# EAGLE design ATtiny_TIP120 (EAGLE 8.0.0)
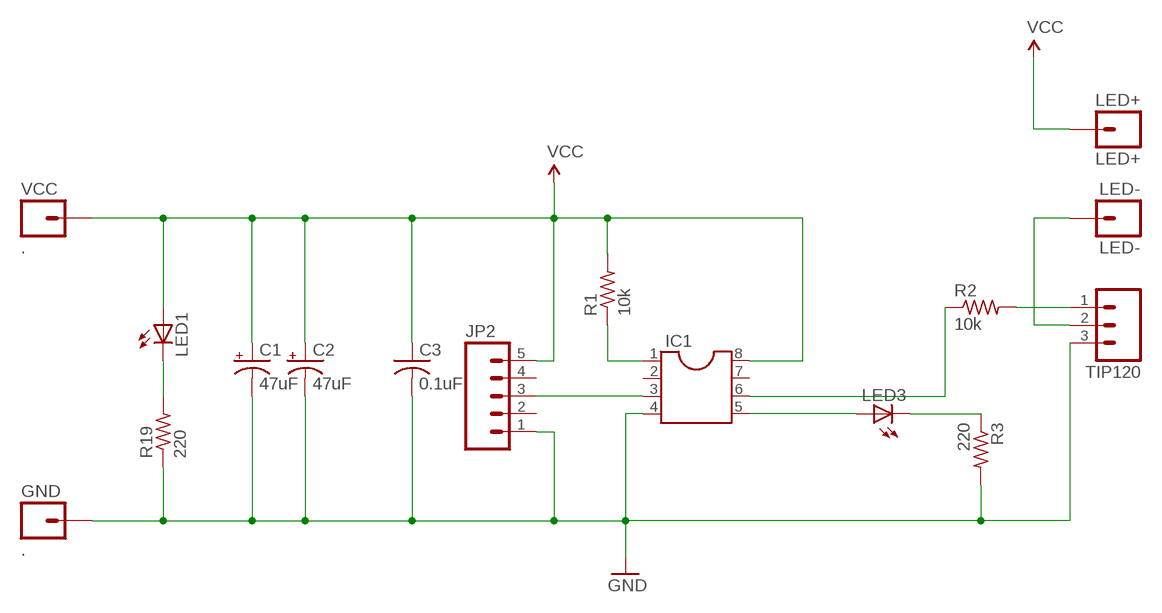
[diagram p0: schematic, sheet 1]

## Parts
C1  47uF  CAP_POLPTH4  [CPOL-RADIAL-1000UF-25V]
C2  47uF  CAP_POLPTH4  [CPOL-RADIAL-1000UF-25V]
C3  0.1uF  C-US025-025X050  [C025-025X050]
GND  .  M01OFFSET  [1X01_OFFSET]
IC1  DIL8S  [SOCKET-08]
JP2  M05LOCK_LONGPADS  [1X05_LOCK_LONGPADS]
LED1  LED5MM  [LED5MM]
LED3  LED5MM  [LED5MM]
LED+  LED+  M01OFFSET  [1X01_OFFSET]
LED-  LED-  M01OFFSET  [1X01_OFFSET]
R1  10k  R-US_0207/7  [0207/7]
R2  10k  R-US_0207/7  [0207/7]
R3  220  R-US_0207/7  [0207/7]
R19  220  R-US_0207/7  [0207/7]
TIP120  M03LOCK_LONGPADS  [1X03_LOCK_LONGPADS]
VCC  .  M01OFFSET  [1X01_OFFSET]

## Nets
GND: C1.2(-) C2.2(-) C3.2 GND.1 IC1.4 JP2.1 R3.2 R19.1 TIP120.3
N$1: IC1.1 R1.1
N$2: IC1.6 R2.1
N$3: IC1.3 JP2.3
N$4: R2.2 TIP120.1
N$6: LED1.K(C) R19.2
N$7: LED3.K(C) R3.1
N$8: LED-.1 TIP120.2
N$10: IC1.5 LED3.A
VCC: C1.1(+) C2.1(+) C3.1 IC1.8 JP2.5 LED1.A LED+.1 R1.2 VCC.1
Unconnected: IC1.2 IC1.7 JP2.2 JP2.4

## Library data of the parts
C1 C2 = SparkFun:CAP_POL: Capacitor Polarized These are standard SMD and PTH capacitors. Normally 10uF, 47uF, and 100uF in electrolytic and tantalum varieties. Always verify the external diameter of the through hole cap, it varies with capacity, voltage, and manufacturer. The EIA devices should be standard.
C3 = adafruit-2014:C-US: CAPACITOR, American symbol
GND LED+ LED- VCC = SparkFun:M01: Header 1 Standard 1-pin 0.1" header. Use with straight break away headers (SKU : PRT-00116), right angle break away headers (PRT-00553), swiss pins (PRT-00743), machine pins (PRT-00117), and female headers (PRT-00115).
IC1 = ic-package:DIL8: Dual In Line / Socket
JP2 = SparkFun:M05: Header 5 Standard 5-pin 0.1" header. Use with straight break away headers (SKU : PRT-00116), right angle break away headers (PRT-00553), swiss pins (PRT-00743), machine pins (PRT-00117), and female headers (PRT-00115). Molex polarized connector foot print use with SKU : PRT-08230 with associated crimp pins and housings.
LED1 LED3 = adafruit-2014:LED: LED OSRAM: - CHIPLED LG R971, LG N971, LY N971, LG Q971, LY Q971, LO R971, LY R971 LH N974, LH R974 LS Q976, LO Q976, LY Q976 LO Q996 - Hyper CHIPLED LW Q18S LB Q993, LB Q99A, LB R99A - SideLED LS A670, LO A670, LY A670, LG A670, LP A670 LB A673, LV A673, LT A673, LW A673 LH A674 LY A675 LS A676, LA A676, LO A676, LY A676, LW A676 LS A679, LY A679, LG A679 - Hyper Micro SIDELED® LS Y876, LA Y876, LO Y876, LY Y876 LT Y87S - SmartLED LW L88C, LW L88S LB L89C, LB L89S, LG L890 LS L89K, LO L89K, LY L89K LS L896, LA L896, LO L896, LY L896 - TOPLED LS T670, LO T670, LY T670, LG T670, LP T670 LSG T670, LSP T670, LSY T670, LOP T670, LYG T670 LG T671, LOG T671, LSG T671 LB T673, LV T673, LT T673, LW T673 LH T674 LS T676, LA T676, LO T676, LY T676, LB T676, LH T676, LSB T676, LW T676 LB T67C, LV T67C, LT T67C, LS T67K, LO T67K, LY T67K, LW E67C LS E67B, LA E67B, LO E67B, LY E67B, LB E67C, LV E67C, LT E67C LW T67C LS T679, LY T679, LG T679 LS T770, LO T770, LY T770, LG T770, LP T770 LB T773, LV T773, LT T773, LW T773 LH T774 LS E675, LA E675, LY E675, LS T675 LS T776, LA T776, LO T776, LY T776, LB T776 LHGB T686 LT T68C, LB T68C - Hyper Mini TOPLED® LB M676 - Mini TOPLED Santana® LG M470 LS M47K, LO M47K, LY M47K Source: http://www.osram.convergy.de/
R1-R3 R19 = adafruit-2014:R-US_: RESISTOR, American symbol
TIP120 = SparkFun:M03: Header 3 Standard 3-pin 0.1" header. Use with straight break away headers (SKU : PRT-00116), right angle break away headers (PRT-00553), swiss pins (PRT-00743), machine pins (PRT-00117), and female headers (PRT-00115). Molex polarized connector foot print use with SKU : PRT-08232 with associated crimp pins and housings.

## Board
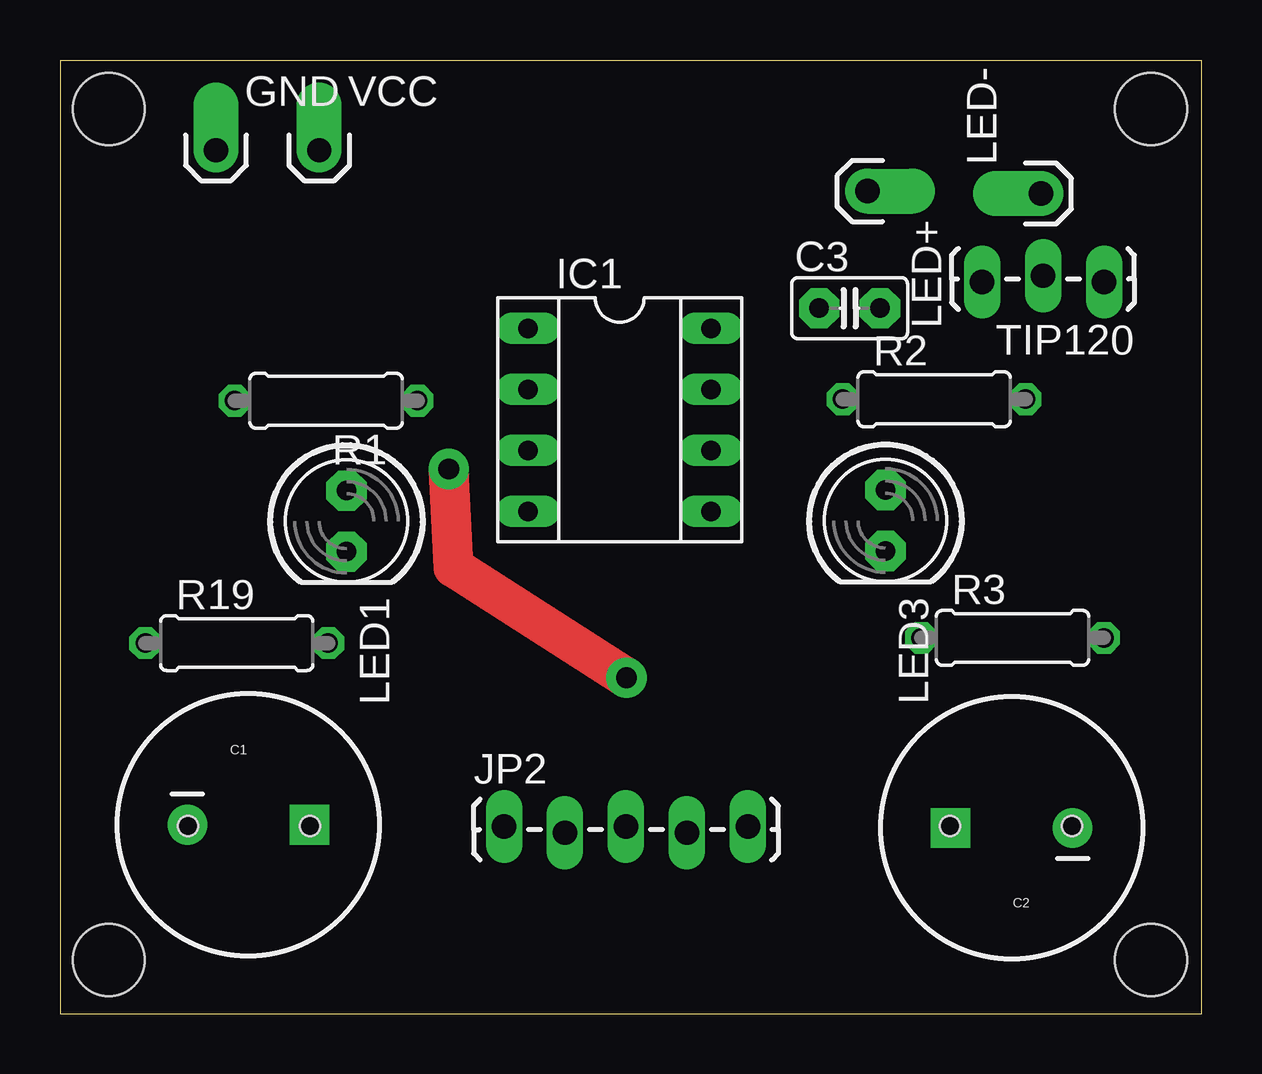
[diagram p1: board, top side]
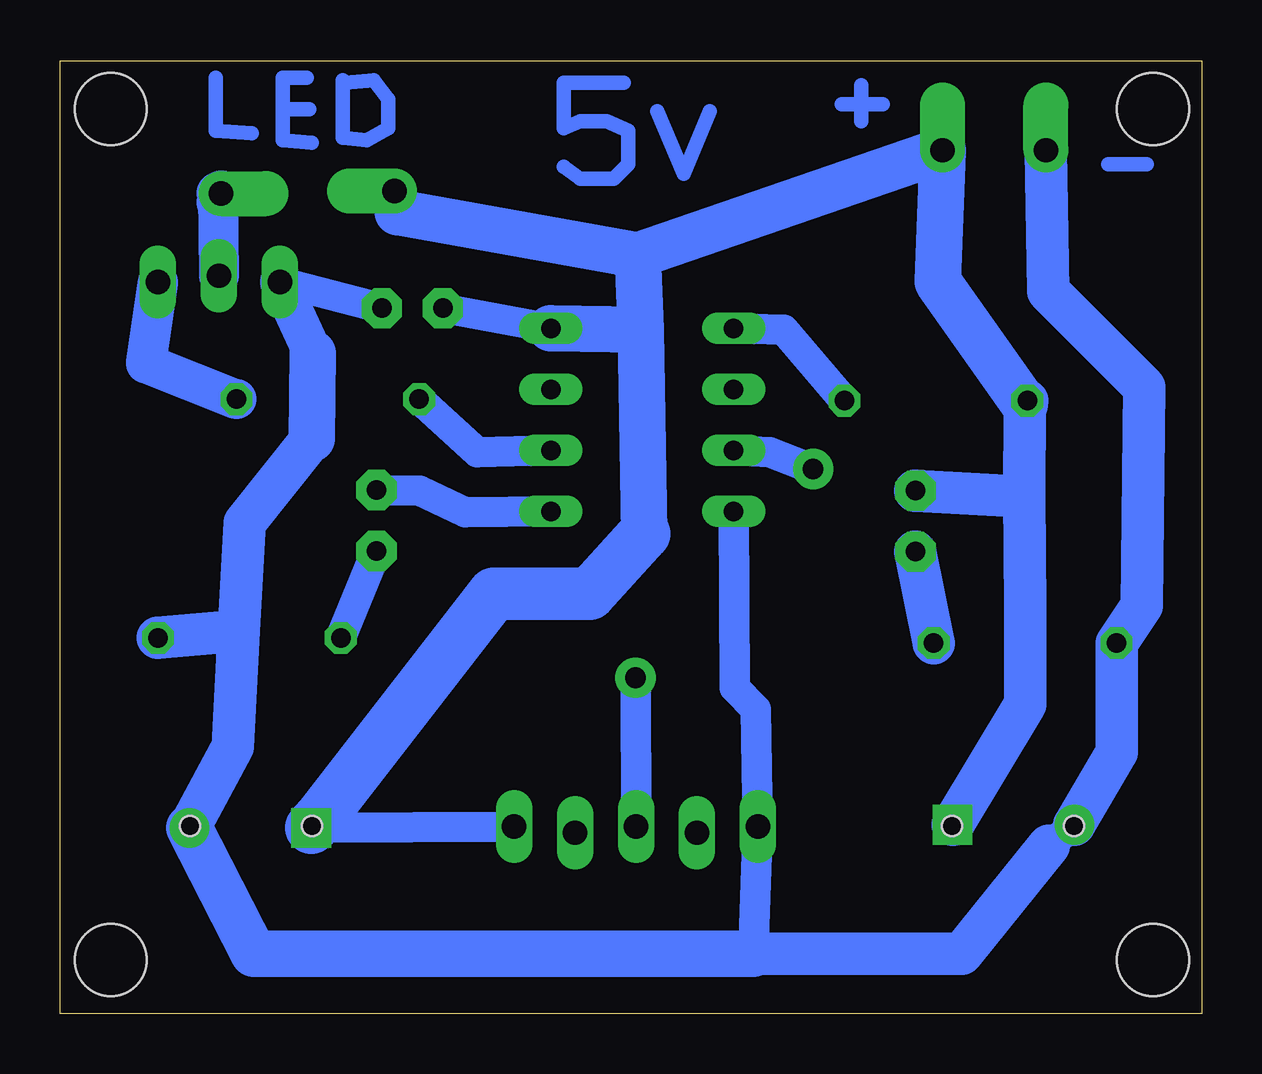
[diagram p2: board, bottom side, seen from below]

Size 47.58 x 39.71 mm. Coordinates in mm from the lower left corner, seen from the top.
Outline: 0,0 47.58,0 47.58,39.71 0,39.71 0,0
Copper layers (1*16): Top 0.035mm / dielectric 1.5mm / Bottom 0.035mm
Design rules "default": minimum track width 10mil, minimum drill 24mil, track to track 8mil, track to pad 8mil, pad to pad 8mil, via to via 8mil, smd to smd 8mil, copper to edge 40mil, drill to drill 8mil, minimum pad ring 10mil, minimum via ring 8mil, stop-mask expansion 4mil, vias tented up to drill 0mil, thermal gap 10mil
Holes 0.84 mm at 10.41,7.83 5.33,7.83 37.08,7.83 42.16,7.83
Holes 3 mm at 2.03,2.24 45.47,2.24 2.03,37.71 45.47,37.71

### Footprints (pad centres in the part's own frame; a part is rotated, then mirrored left to right if it is on the bottom)
CPOL-RADIAL-1000UF-25V = drill 0.7 pad 1.651 square: 1 2.54,0 | drill 0.7 pad 1.651: 2 -2.54,0
C025-025X050 = drill 0.813 pad 1.676 octagon: 1 -1.27,0; 2 1.27,0
1X01_OFFSET = drill 1.016 pad 1.88 offset: 1 0,0
SOCKET-08 = drill 0.813 long: 1 -3.81,-3.81; 2 -1.27,-3.81; 3 1.27,-3.81; 4 3.81,-3.81; 5 3.81,3.81; 6 1.27,3.81; 7 -1.27,3.81; 8 -3.81,3.81
1X05_LOCK_LONGPADS = drill 1.016 long: 1 0,0; 2 2.54,-0.254; 3 5.08,0; 4 7.62,-0.254; 5 10.16,0
LED5MM = drill 0.813 pad 1.676 octagon: A -1.27,0; K 1.27,0
0207/7 = drill 0.813 octagon: 1 -3.81,0; 2 3.81,0
1X03_LOCK_LONGPADS = drill 1.016 long: 1 0,0; 2 2.54,-0.254; 3 5.08,0

### Placement (x,y rotation side)
C1  7.85,7.88 0 top
C2  39.65,7.75 180 top
C3  32.9,29.4 0 top
GND  6.5,35.98 0 top
IC1  23.32,24.75 270 top
JP2  18.5,7.8 0 top
LED1  11.94,20.53 270 top
LED3  34.39,20.55 270 top
LED+  33.64,34.28 270 top
LED-  40.87,34.18 90 top
R1  11.09,25.55 180 top
R2  36.42,25.61 0 top
R3  39.69,15.66 0 top
R19  7.37,15.45 0 top
TIP120  43.5,30.5 180 top
VCC  10.8,35.98 0 top

### Tracks (layer width: path | path; a pad name or v marks a point on that pad's centre or on a via)
GND
  Bottom 1.27: 6.37,7.01 C1.2 | C3.2 TIP120.3 | IC1.4 19.46,13.6 18.6,12.7 JP2.1 18.7,2.5
  Bottom 1.676: TIP120.3 37.06,27.53
  Bottom 1.778: C2.2 40.39,11.13 40.13,15.96 | 40.13,15.96 39.88,20.47 37.09,23.96 | R3.2 40.13,15.96 | C1.2 3.56,10.89 R19.1 2.5,17 2.4,26.1 6.4,30.1 GND.1 | 18.7,2.5 10,2.5 6.37,7.01
  Bottom 1.93: 37.09,23.96 37.06,27.53 | 18.7,2.5 39.5,2.5 C2.2
N$1
  Bottom 1.27: IC1.1 17.42,28.5 R1.1
N$2
  Bottom 1.27: IC1.6 30.2,23.4 R2.1
N$3  (via drill 0.86 pad 1.68)
  Top 1.676: v23.6,14 16.4,18.6 v16.2,22.7
  Bottom 1.27: v16.2,22.7 18,23.4 IC1.3 | JP2.3 v23.6,14
N$4
  Bottom 1.676: TIP120.1 44,27.1 R2.2
N$5
  Bottom 0.61: 24.1,38.8 26.6,38.8 26.6,36.9 25.9,37.2 24.8,37.2 23.9,36.8 23.9,35.4 24.5,34.8 25.9,34.8 26.6,35.3
N$6
  Bottom 1.778: R19.2 LED1.K
N$7
  Bottom 1.27: LED3.K R3.1
N$8
  Bottom 1.676: 41,34.19 TIP120.2
  Bottom 1.778: 40.92,33.81 41,34.19
  Bottom 1.93: LED-.1 40.92,33.81
N$9
  Bottom 0.61: 20.5,37.6 21.6,35 22.7,37.6
N$10
  Bottom 1.27: IC1.5 30.7,20.9 32.6,21.8 LED3.A
N$11
  Bottom 0.61: 41.1,39 41.1,36.8 39.6,36.7
N$12
  Bottom 0.61: 37.1,36.3 38.3,36.4 38.3,39 37.3,39
N$13
  Bottom 0.61: 38.2,37.7 37.2,37.7
N$14
  Bottom 0.61: 35.8,38.9 35.8,36.5 34.8,36.4 33.9,36.9 33.9,38.1 34.5,38.9 35.7,38.8
N$15
  Bottom 0.61: 2.3,35.4 3.9,35.4
N$16
  Bottom 0.61: 14.2,38.7 14.2,37.2
N$17
  Bottom 0.61: 13.3,37.9 15,37.9
VCC
  Bottom 1.27: IC1.8 C3.1 | JP2.5 C2.1
  Bottom 1.778: 7.41,21.55 7.37,25.38 R1.2 | C1.1 7.37,12.91 7.37,16.99 7.41,21.55 | LED1.A 7.41,21.55 | 33.5,33.4 LED+.1
  Bottom 1.93: 23.38,28.51 23.25,20.01 | 23.38,28.51 23.5,31.6 | 23.5,31.6 VCC.1 11,30.5 7.37,25.38 | 23.5,31.6 33.5,33.4 | 23.38,28.51 IC1.8
  Bottom 2.184: C2.1 36.76,8.16 29.5,17.5 25.5,17.5 23.25,20.01